# Altium schematic sheet STM32.SchDoc
size A; SheetNumber: 4; SheetTotal: 5
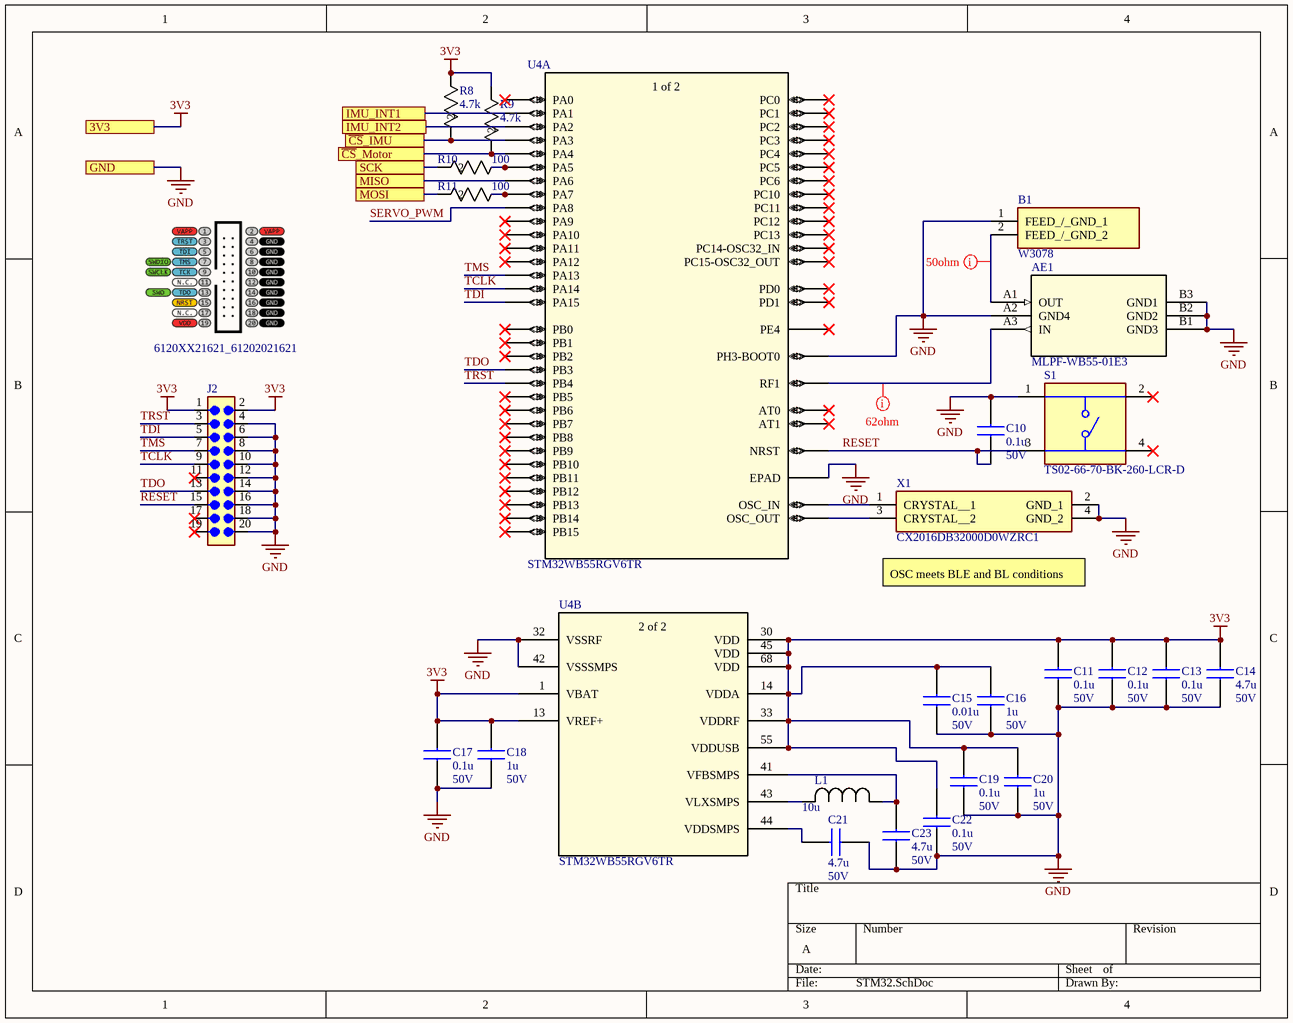
[diagram p0: STM32.SchDoc]

## Parts
AE1  MLPF-WB55-01E3  [MLPF-WB55-01E3_STM]
B1  W3078  [W3078]
C10  value 0.1u  Rated Voltage: 50V  [CAPC2012X145N]  (hidden comment: KAM21BR71H104JM)
C11  value 0.1u  Rated Voltage: 50V  [CAPC2012X145N]  (hidden comment: KAM21BR71H104JM)
C12  value 0.1u  Rated Voltage: 50V  [CAPC2012X145N]  (hidden comment: KAM21BR71H104JM)
C13  value 0.1u  Rated Voltage: 50V  [CAPC2012X145N]  (hidden comment: KAM21BR71H104JM)
C14  value 4.7u  Rated Voltage: 50V  [CAPC2012X145N]  (hidden comment: C2012X5R1H475M125AB)
C15  value 0.01u  Rated Voltage: 50V  [CAPC2012X145N]  (hidden comment: KAM21BR71H103KT)
C16  value 1u  Rated Voltage: 50V  [CAPC2012X145N]  (hidden comment: KGM21AR51H105KU)
C17  value 0.1u  Rated Voltage: 50V  [CAPC2012X145N]  (hidden comment: KAM21BR71H104JM)
C18  value 1u  Rated Voltage: 50V  [CAPC2012X145N]  (hidden comment: KGM21AR51H105KU)
C19  value 0.1u  Rated Voltage: 50V  [CAPC2012X145N]  (hidden comment: KAM21BR71H104JM)
C20  value 1u  Rated Voltage: 50V  [CAPC2012X145N]  (hidden comment: KGM21AR51H105KU)
C21  value 4.7u  Rated Voltage: 50V  [CAPC2012X145N]  (hidden comment: C2012X5R1H475M125AB)
C22  value 0.1u  Rated Voltage: 50V  [CAPC2012X145N]  (hidden comment: KAM21BR71H104JM)
C23  value 4.7u  Rated Voltage: 50V  [CAPC2012X145N]  (hidden comment: C2012X5R1H475M125AB)
J2  6120XX21621_61202021621  [61202021621]
L1  value 10u  [IND_LQM21FN100M80L_MUR]  (hidden comment: LQM21FN100M80L)
R8  value 4.7k  [RC0805N_YAG]  (hidden comment: RC0805JR-074K7L)
R9  value 4.7k  [RC0805N_YAG]  (hidden comment: RC0805JR-074K7L)
R10  value 100  [RC0805N_YAG]  (hidden comment: RC0805JR-07100RL)
R11  value 100  [RC0805N_YAG]  (hidden comment: RC0805JR-07100RL)
S1  TS02-66-70-BK-260-LCR-D  [SW_TS02-66-70-BK-260-LCR-D]
U4  STM32WB55RGV6TR  [VFQFN68-8x8mm]  (parts A,B of 2)
X1  CX2016DB32000D0WZRC1  [CX2016DB32000D0WZRC1]

## Ports
3V3, GND, IMU_INT1, IMU_INT2, MISO, MOSI, SCK, ~{CS}_IMU, ~{CS}_Motor

## Nets
3V3: C11.2 C12.2 C13.2 C14.2 C15.2 C16.2 C17.2 C18.2 C19.2 C20.2 C22.2 J2.1 J2.2 R8.1 R9.1 U4.1(VBAT) U4.13(VREF+) U4.14(VDDA) U4.30(VDD) U4.33(VDDRF) U4.45(VDD) U4.55(VDDUSB) U4.68(VDD) ; port 3V3
GND: AE1.A2(GND4) AE1.B1(GND3) AE1.B2(GND2) AE1.B3(GND1) B1.1(FEED_/_GND_1) C10.2 C11.1 C12.1 C13.1 C14.1 C15.1 C16.1 C17.1 C18.1 C19.1 C20.1 C21.1 C22.1 C23.1 J2.4 J2.6 J2.8 J2.10 J2.12 J2.14 J2.16 J2.18 J2.20 S1.1 U4.5(PH3-BOOT0) U4.32(VSSRF) U4.42(VSSSMPS) U4.69(EPAD) X1.2(GND_1) X1.4(GND_2) ; port GND
~{CS}_IMU: R8.2 U4.18(PA3) ; port ~{CS}_IMU
~{CS}_Motor: R9.2 U4.19(PA4) ; port ~{CS}_Motor
IMU_INT1: U4.16(PA1) ; port IMU_INT1
IMU_INT2: U4.17(PA2) ; port IMU_INT2
MISO: U4.21(PA6) ; port MISO
MOSI: R11.2 ; port MOSI
RESET: C10.1 J2.15 S1.3 U4.8(NRST)
SCK: R10.2 ; port SCK
SERVO_PWM: U4.23(PA8)
TCLK: J2.9 U4.56(PA14)
TDI: J2.5 U4.57(PA15)
TDO: J2.13 U4.63(PB3)
TMS: J2.7 U4.54(PA13)
TRST: J2.3 U4.64(PB4)
NetAE1_A1: AE1.A1(OUT) B1.2(FEED_/_GND_2)
NetAE1_A3: AE1.A3(IN) U4.31(RF1)
NetC21_2: C21.2 U4.44(VDDSMPS)
NetC23_2: C23.2 L1.1 U4.41(VFBSMPS)
NetL1_2: L1.2 U4.43(VLXSMPS)
NetR10_1: R10.1 U4.20(PA5)
NetR11_1: R11.1 U4.22(PA7)
NetU4_34: U4.34(OSC_OUT) X1.3(CRYSTAL__2)
NetU4_35: U4.35(OSC_IN) X1.1(CRYSTAL__1)

Not connected (* = marked no-connect by the designer): J2 11* 17* 19*; S1 2* 4*; U4 2(PC13)* 3(PC14-OSC32_IN)* 4(PC15-OSC32_OUT)* 6(PB8)* 7(PB9)* 9(PC0)* 10(PC1)* 11(PC2)* 12(PC3)* 15(PA0)* 24(PA9)* 25(PC4)* 26(PC5)* 27(PB2)* 28(PB10)* 29(PB11)* 36(AT0)* 37(AT1)* 38(PB0)* 39(PB1)* 40(PE4)* 46(PB12)* 47(PB13)* 48(PB14)* 49(PB15)* 50(PC6)* 51(PA10)* 52(PA11)* 53(PA12)* 58(PC10)* 59(PC11)* 60(PC12)* 61(PD0)* 62(PD1)* 65(PB5)* 66(PB6)* 67(PB7)*

## Layout directives
net class S62: NetAE1_A3
net class S50: NetAE1_A1

## Notes on the sheet
- (near X1) OSC meets BLE and BL conditions
- (in symbol STM32WB55RGV6TR, part A) 1 of 2
- (in symbol STM32WB55RGV6TR, part B) 2 of 2

## Library data of the parts
AE1 = MLPF-WB55-01E3: 2.4 GHz Matched filter companion chip for STM32WB55Cx and STM32WB55Rx; Manufacturer_Name: STMicroelectronics; Copyright: Copyright (C) 2025 Ultra Librarian. All rights reserved.; Manufacturer_Part_Number: MLPF-WB55-01E3; Datasheet: https://www.st.com/resource/en/datasheet/mlpf-wb55-01e3.pdf; RefDes: RefDes; Type: Type
B1 = W3078: Antennas CERAMIC W3078 GC380H N; Manufacturer_Name: PULSE; Geometry.Height: 1.2mm; Mouser Part Number: 673-W3078; Mouser Price/Stock: https://www.mouser.co.uk/ProductDetail/Pulse-Electronics/W3078?qs=k0bvAmZt86CkgrK3%2FGxl6Q%3D%3D; Manufacturer_Part_Number: W3078; Datasheet Link: https://datasheet.datasheetarchive.com/originals/distributors/DKDS-10/182581.pdf
C10-C13 C17 C19 C22 = KAM21BR71H104JM: Multilayer Ceramic Chip Capacitors, Capacitance=0.1u; Manufacturer_Part_Number: KAM21BR71H104JM
C14 C21 C23 = C2012X5R1H475M125AB: Multilayer Ceramic Chip Capacitors, Capacitance=4.7u; Manufacturer_Part_Number: GCM21BR71H474KA55K
C15 = KAM21BR71H103KT: Multilayer Ceramic Chip Capacitors, Capacitance=0.01u; Manufacturer_Part_Number: KAM21BR71H103KT
C16 C18 C20 = KGM21AR51H105KU: Multilayer Ceramic Chip Capacitors, Capacitance=1u; Manufacturer_Part_Number: KGM21AR51H105KU
J2 = 6120XX21621_61202021621: MF: {'manufacturer': u'W\xfcrth Elektronik'}; Package: None; Price: None; Value: *; MP: 61202021621; Availability: Unavailable
L1 = LQM21FN100M80L: No Description Available; Manufacturer_Name: Murata; Copyright: Copyright (C) 2025 Ultra Librarian. All rights reserved.; Manufacturer_Part_Number: LQM21FN100M80L
R8 R9 = RC0805JR-074K7L: RES 0805 4.7k 5% 1/8W; Manufacturer_Name: Yageo; Manufacturer_Part_Number: RC0805JR-074K7L; Tolerance: 5%
R10 R11 = RC0805JR-07100RL: RES 0805 100 5% 1/8W; Manufacturer_Name: Yageo; Manufacturer_Part_Number: RC0805JR-07100RL; Tolerance: 5%
S1 = TS02-66-70-BK-260-LCR-D: 6 x 6 mm, 7 mm Actuator Height, 260 gf, Black, Long Crimped, Through Hole, SPST, Tactile Switch; MF: Same Sky; SnapEDA_Link: https://www.snapeda.com/parts/TS02-66-70-BK-260-LCR-D/Same+Sky/view-part/?ref=snap; Package: None; Value: *; MP: TS02-66-70-BK-260-LCR-D; Check_prices: https://www.snapeda.com/parts/TS02-66-70-BK-260-LCR-D/Same+Sky/view-part/?ref=eda
U4 = STM32WB55RGV6TR: Ultra-low-power dual core Arm Cortex-M4 MCU 64 MHz, Cortex-M0+ 32 MHz with 1 Mbyte of Flash memory, Bluetooth LE 5.4, 802.15.4, Zigbee, Thread, Matter, USB, LCD, AES-256; Manufacturer_Name: STMicroelectronics; Copyright: Copyright (C) 2025 Ultra Librarian. All rights reserved.; Manufacturer_Part_Number: STM32WB55RGV6TR; Datasheet: https://www.st.com/resource/en/datasheet/stm32wb55cc.pdf; RefDes: RefDes; Type: Type
X1 = CX2016DB32000D0WZRC1: 32 MHz +/-25ppm Crystal 8pF 60 Ohms 4-SMD, No Lead; Manufacturer_Name: Kyocera AVX; Geometry.Height: 0.45mm; Mouser Part Number: 581-CX2016DB32DWZRC1; Mouser Price/Stock: https://www.mouser.co.uk/ProductDetail/KYOCERA-AVX/CX2016DB32000D0WZRC1?qs=mHG8nxlouK5LiZGb%2FcBxwg%3D%3D; Manufacturer_Part_Number: CX2016DB32000D0WZRC1; Datasheet Link: https://ele.kyocera.com/assets/products/crystal-device/cx2016db_e.pdf